# EAGLE schematic power_v1 (EAGLE 8.2.1)
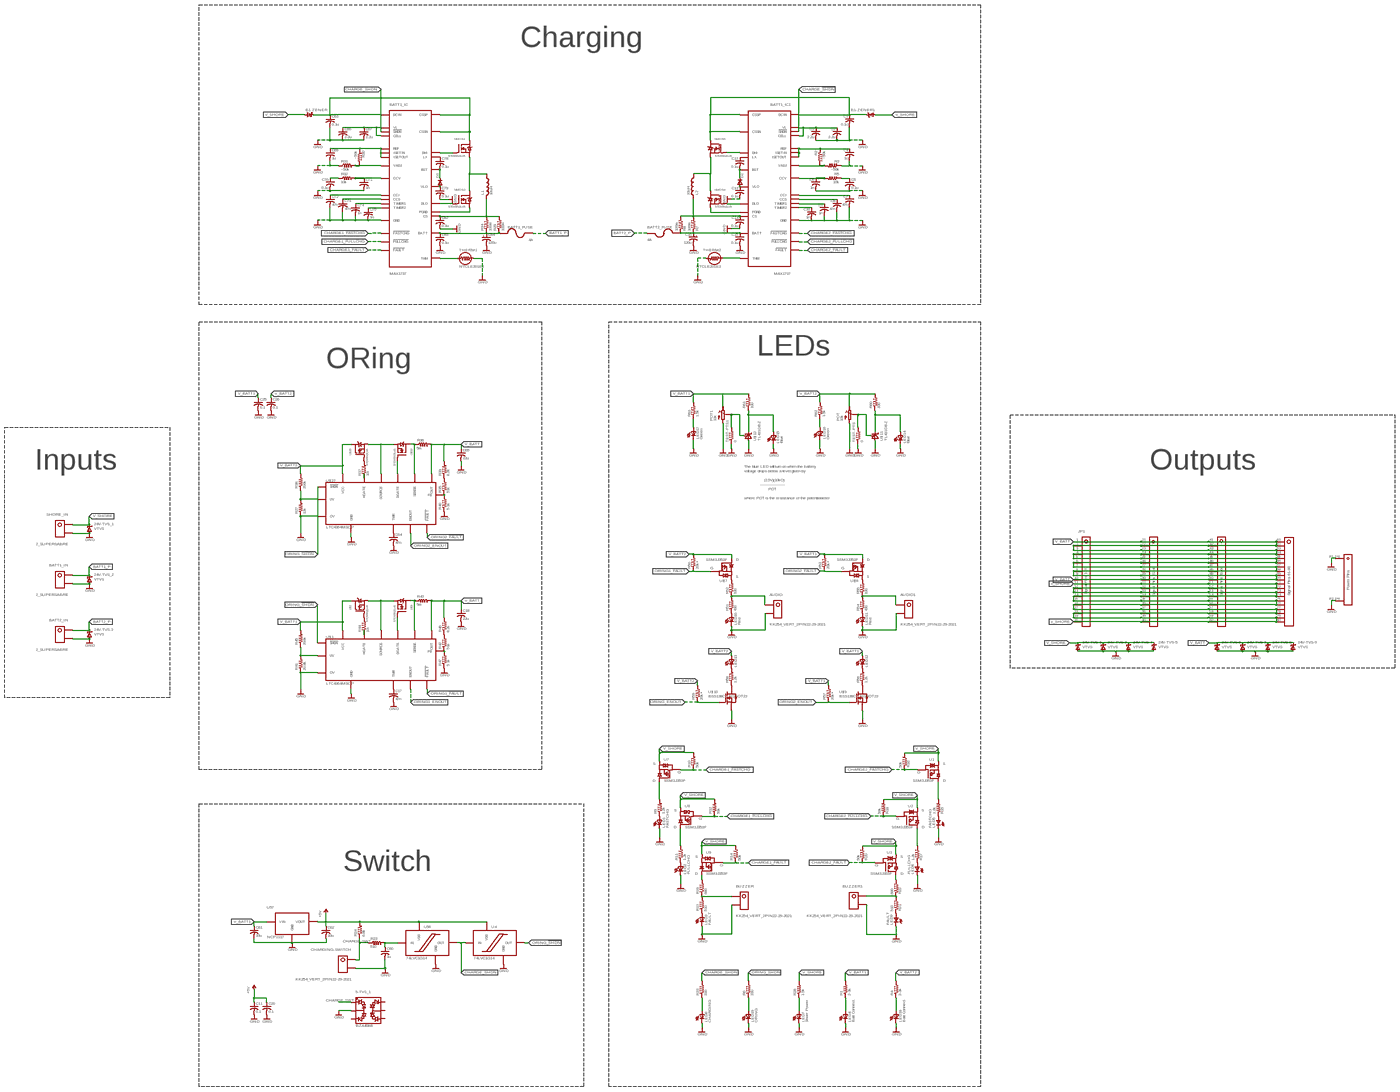
[diagram p0: schematic, sheet 1, overview]
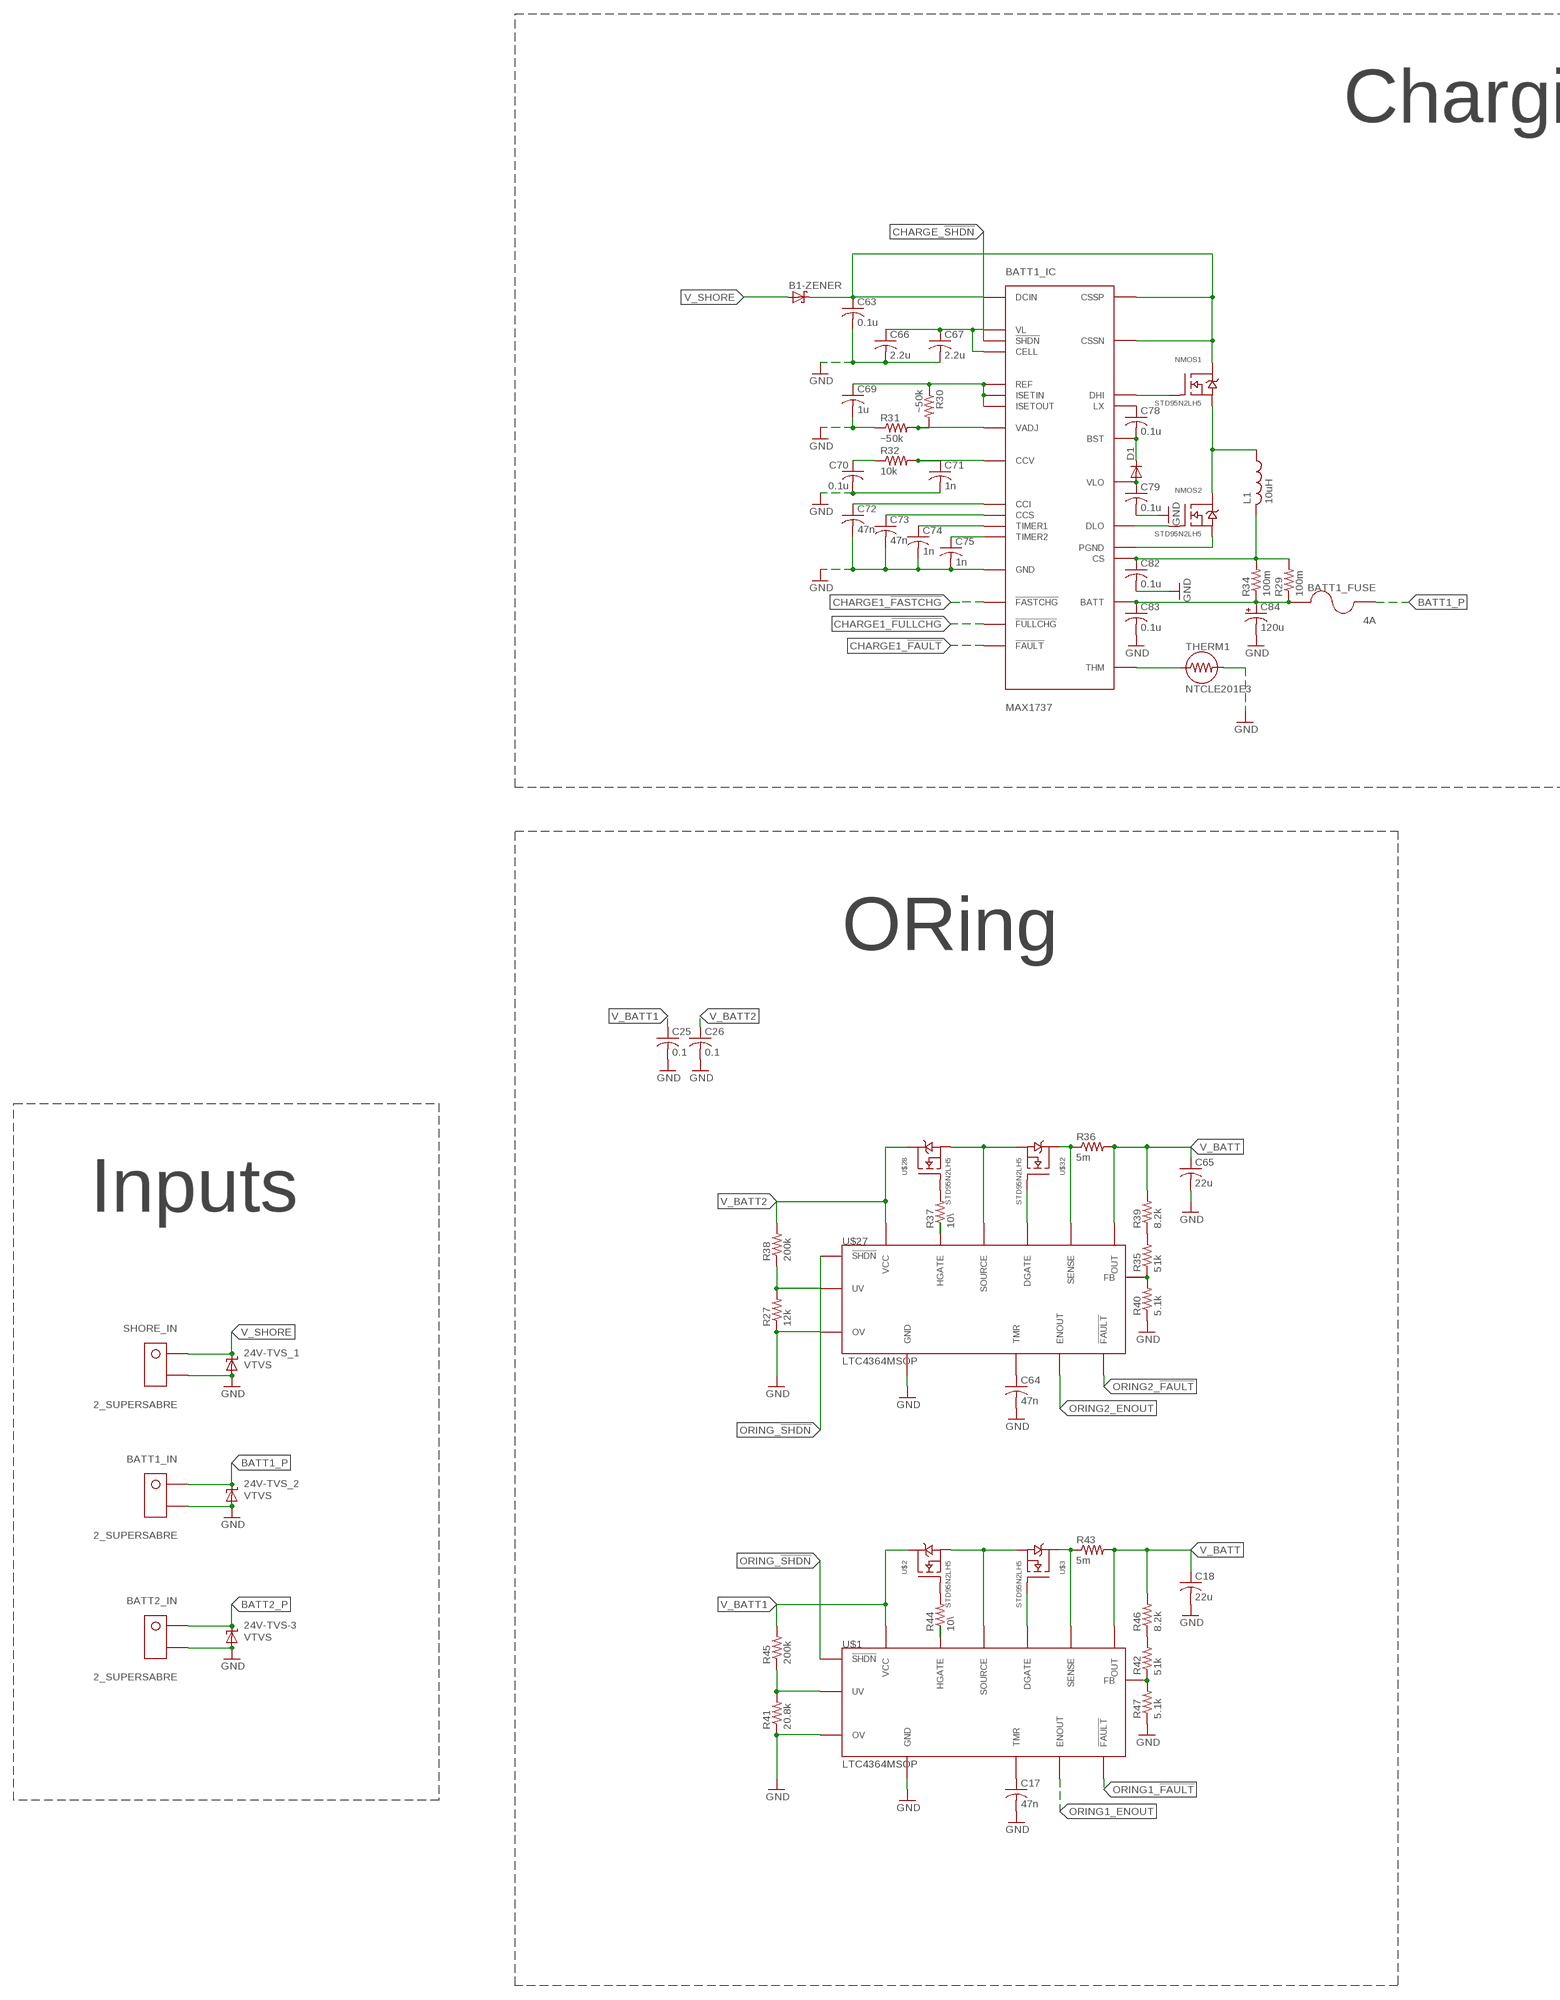
[diagram p1: schematic, sheet 1, part 1 of 4]
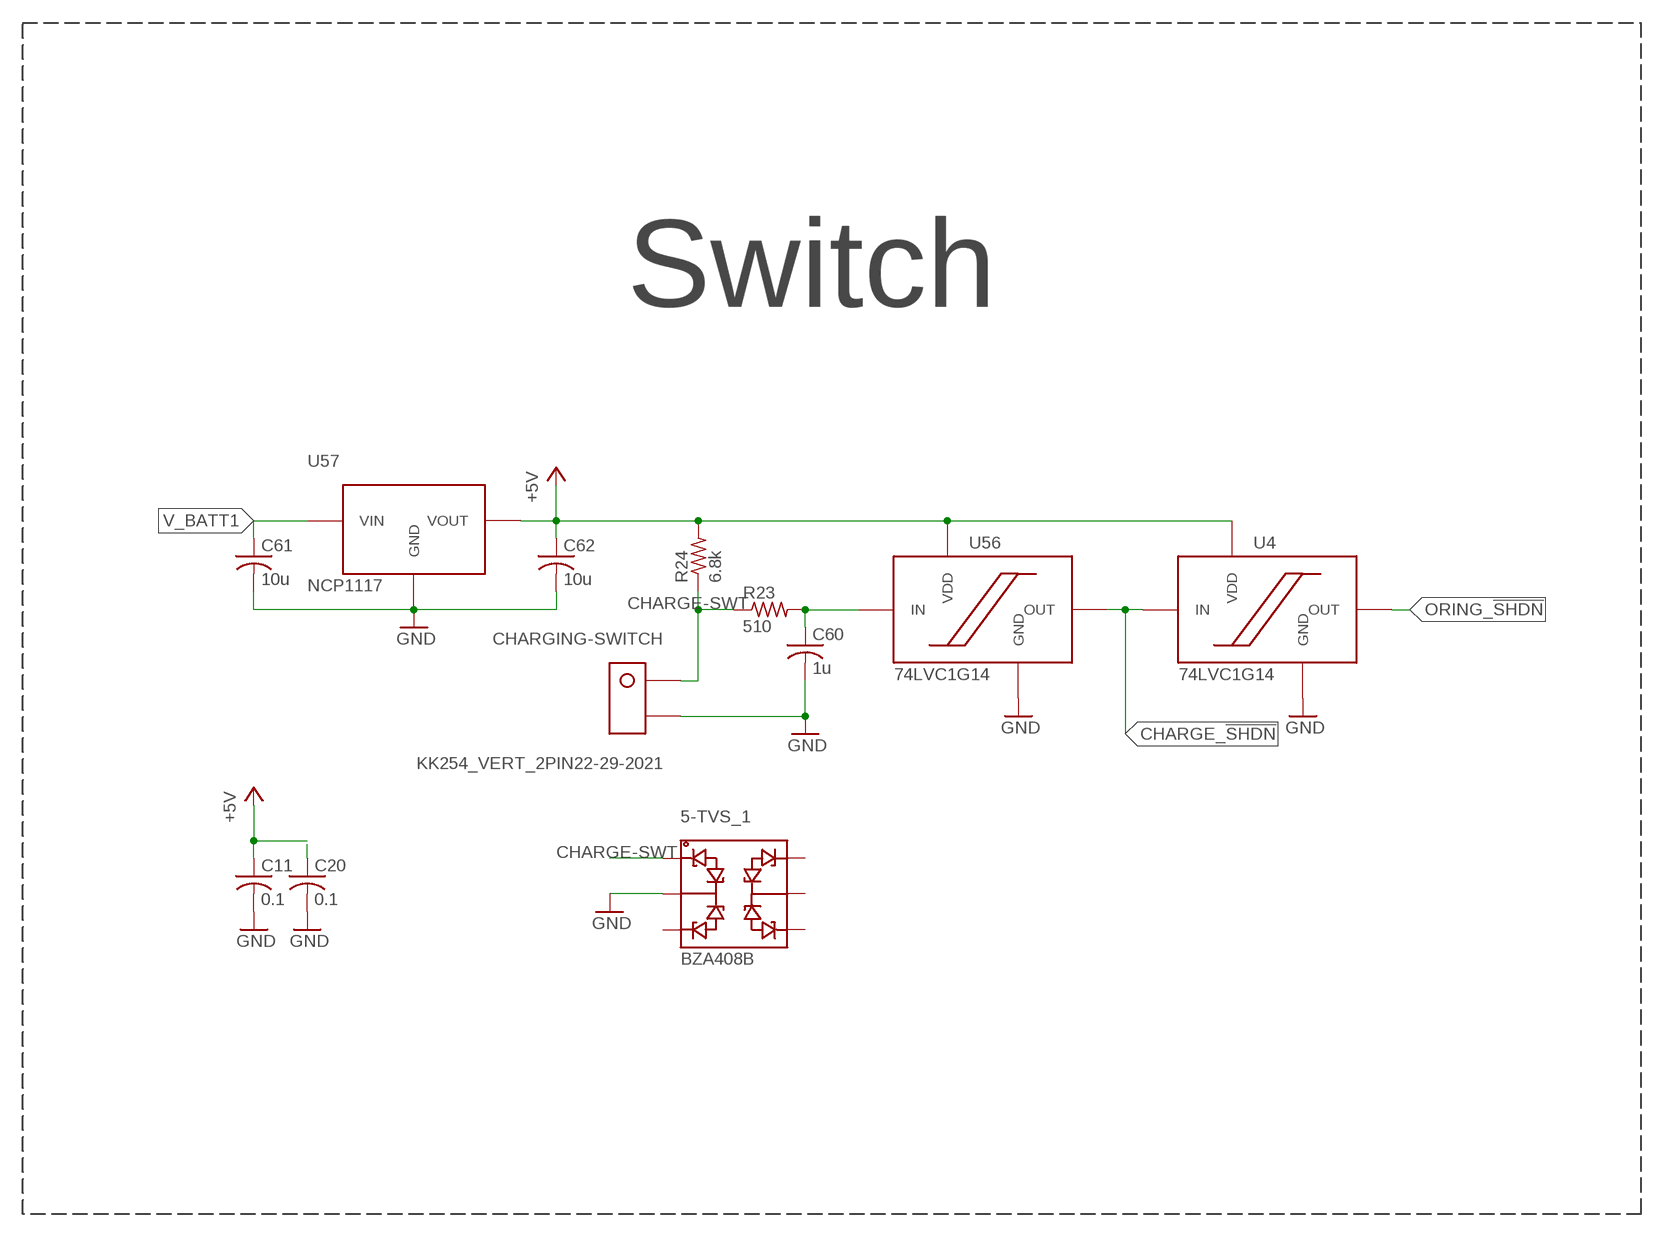
[diagram p2: schematic, sheet 1, part 2 of 4]
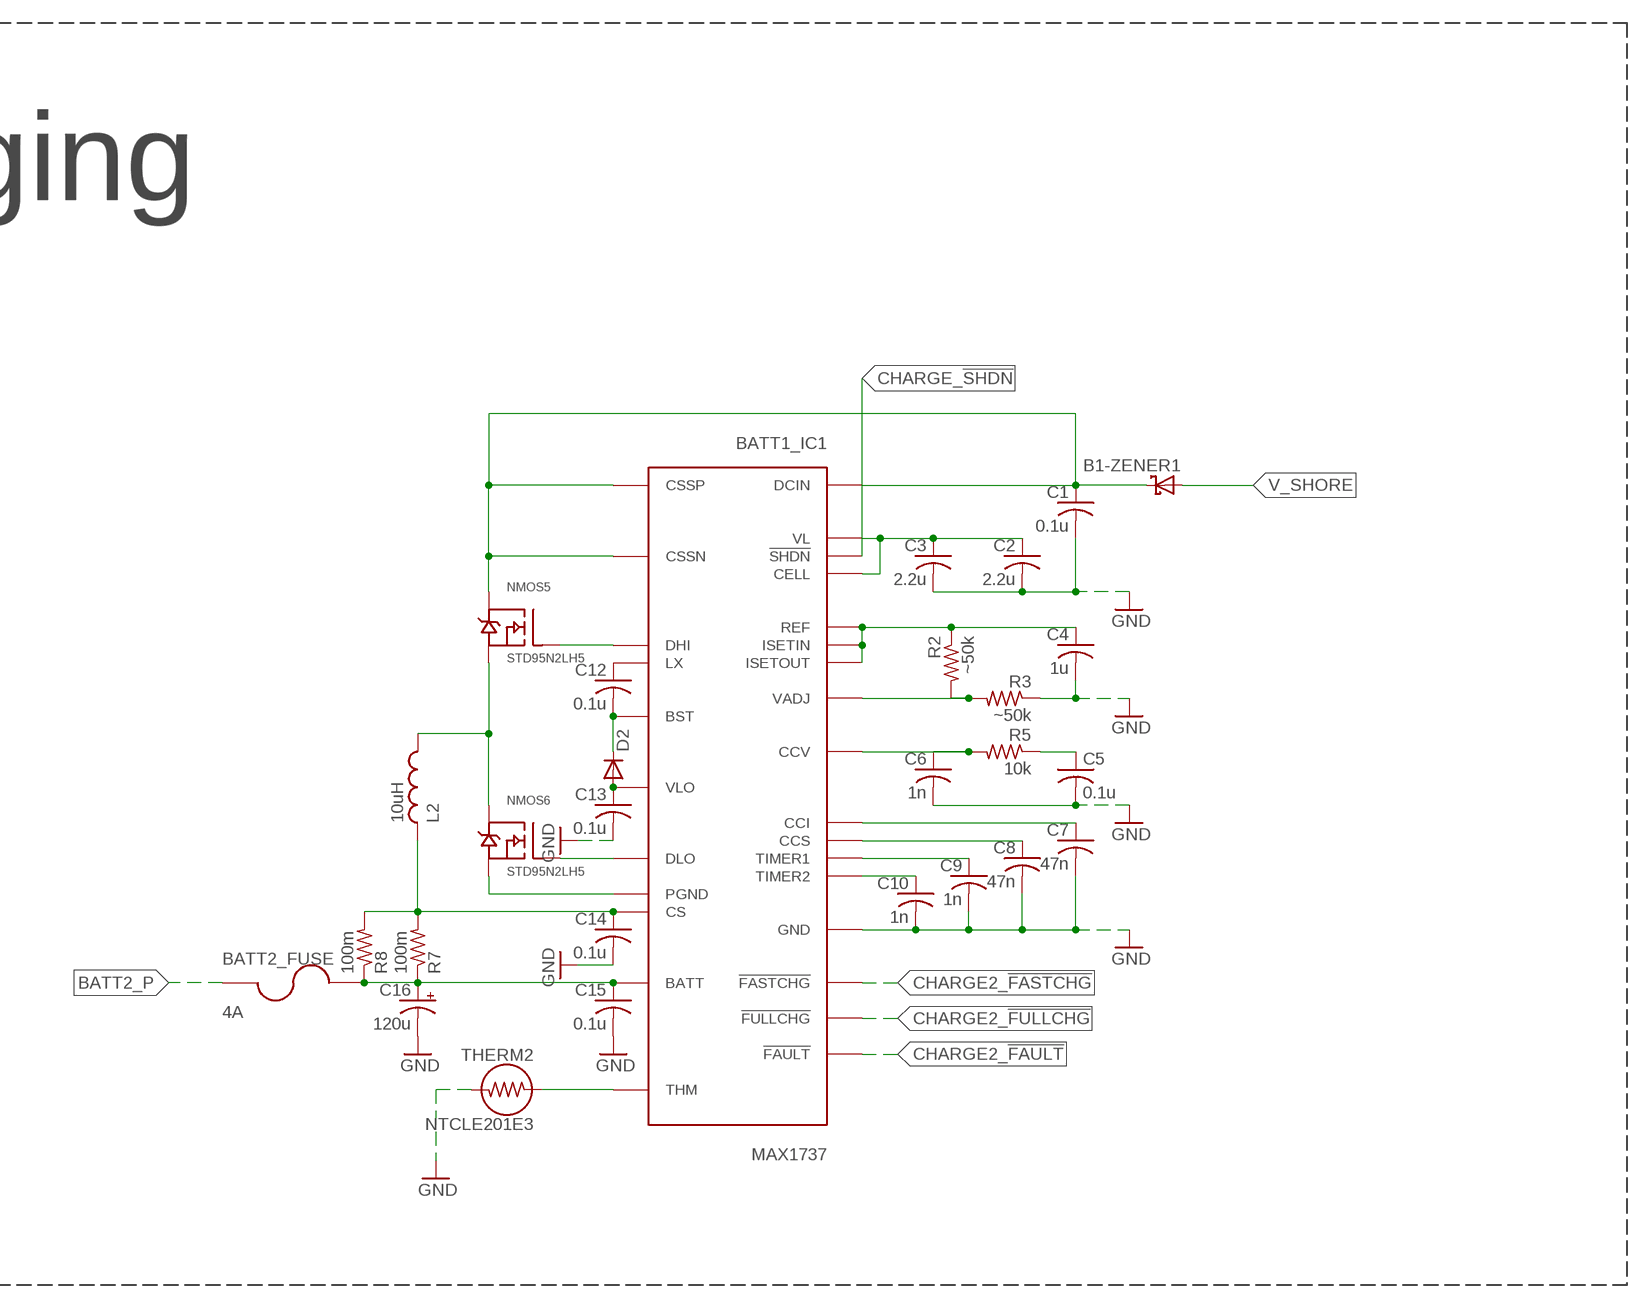
[diagram p3: schematic, sheet 1, part 3 of 4]
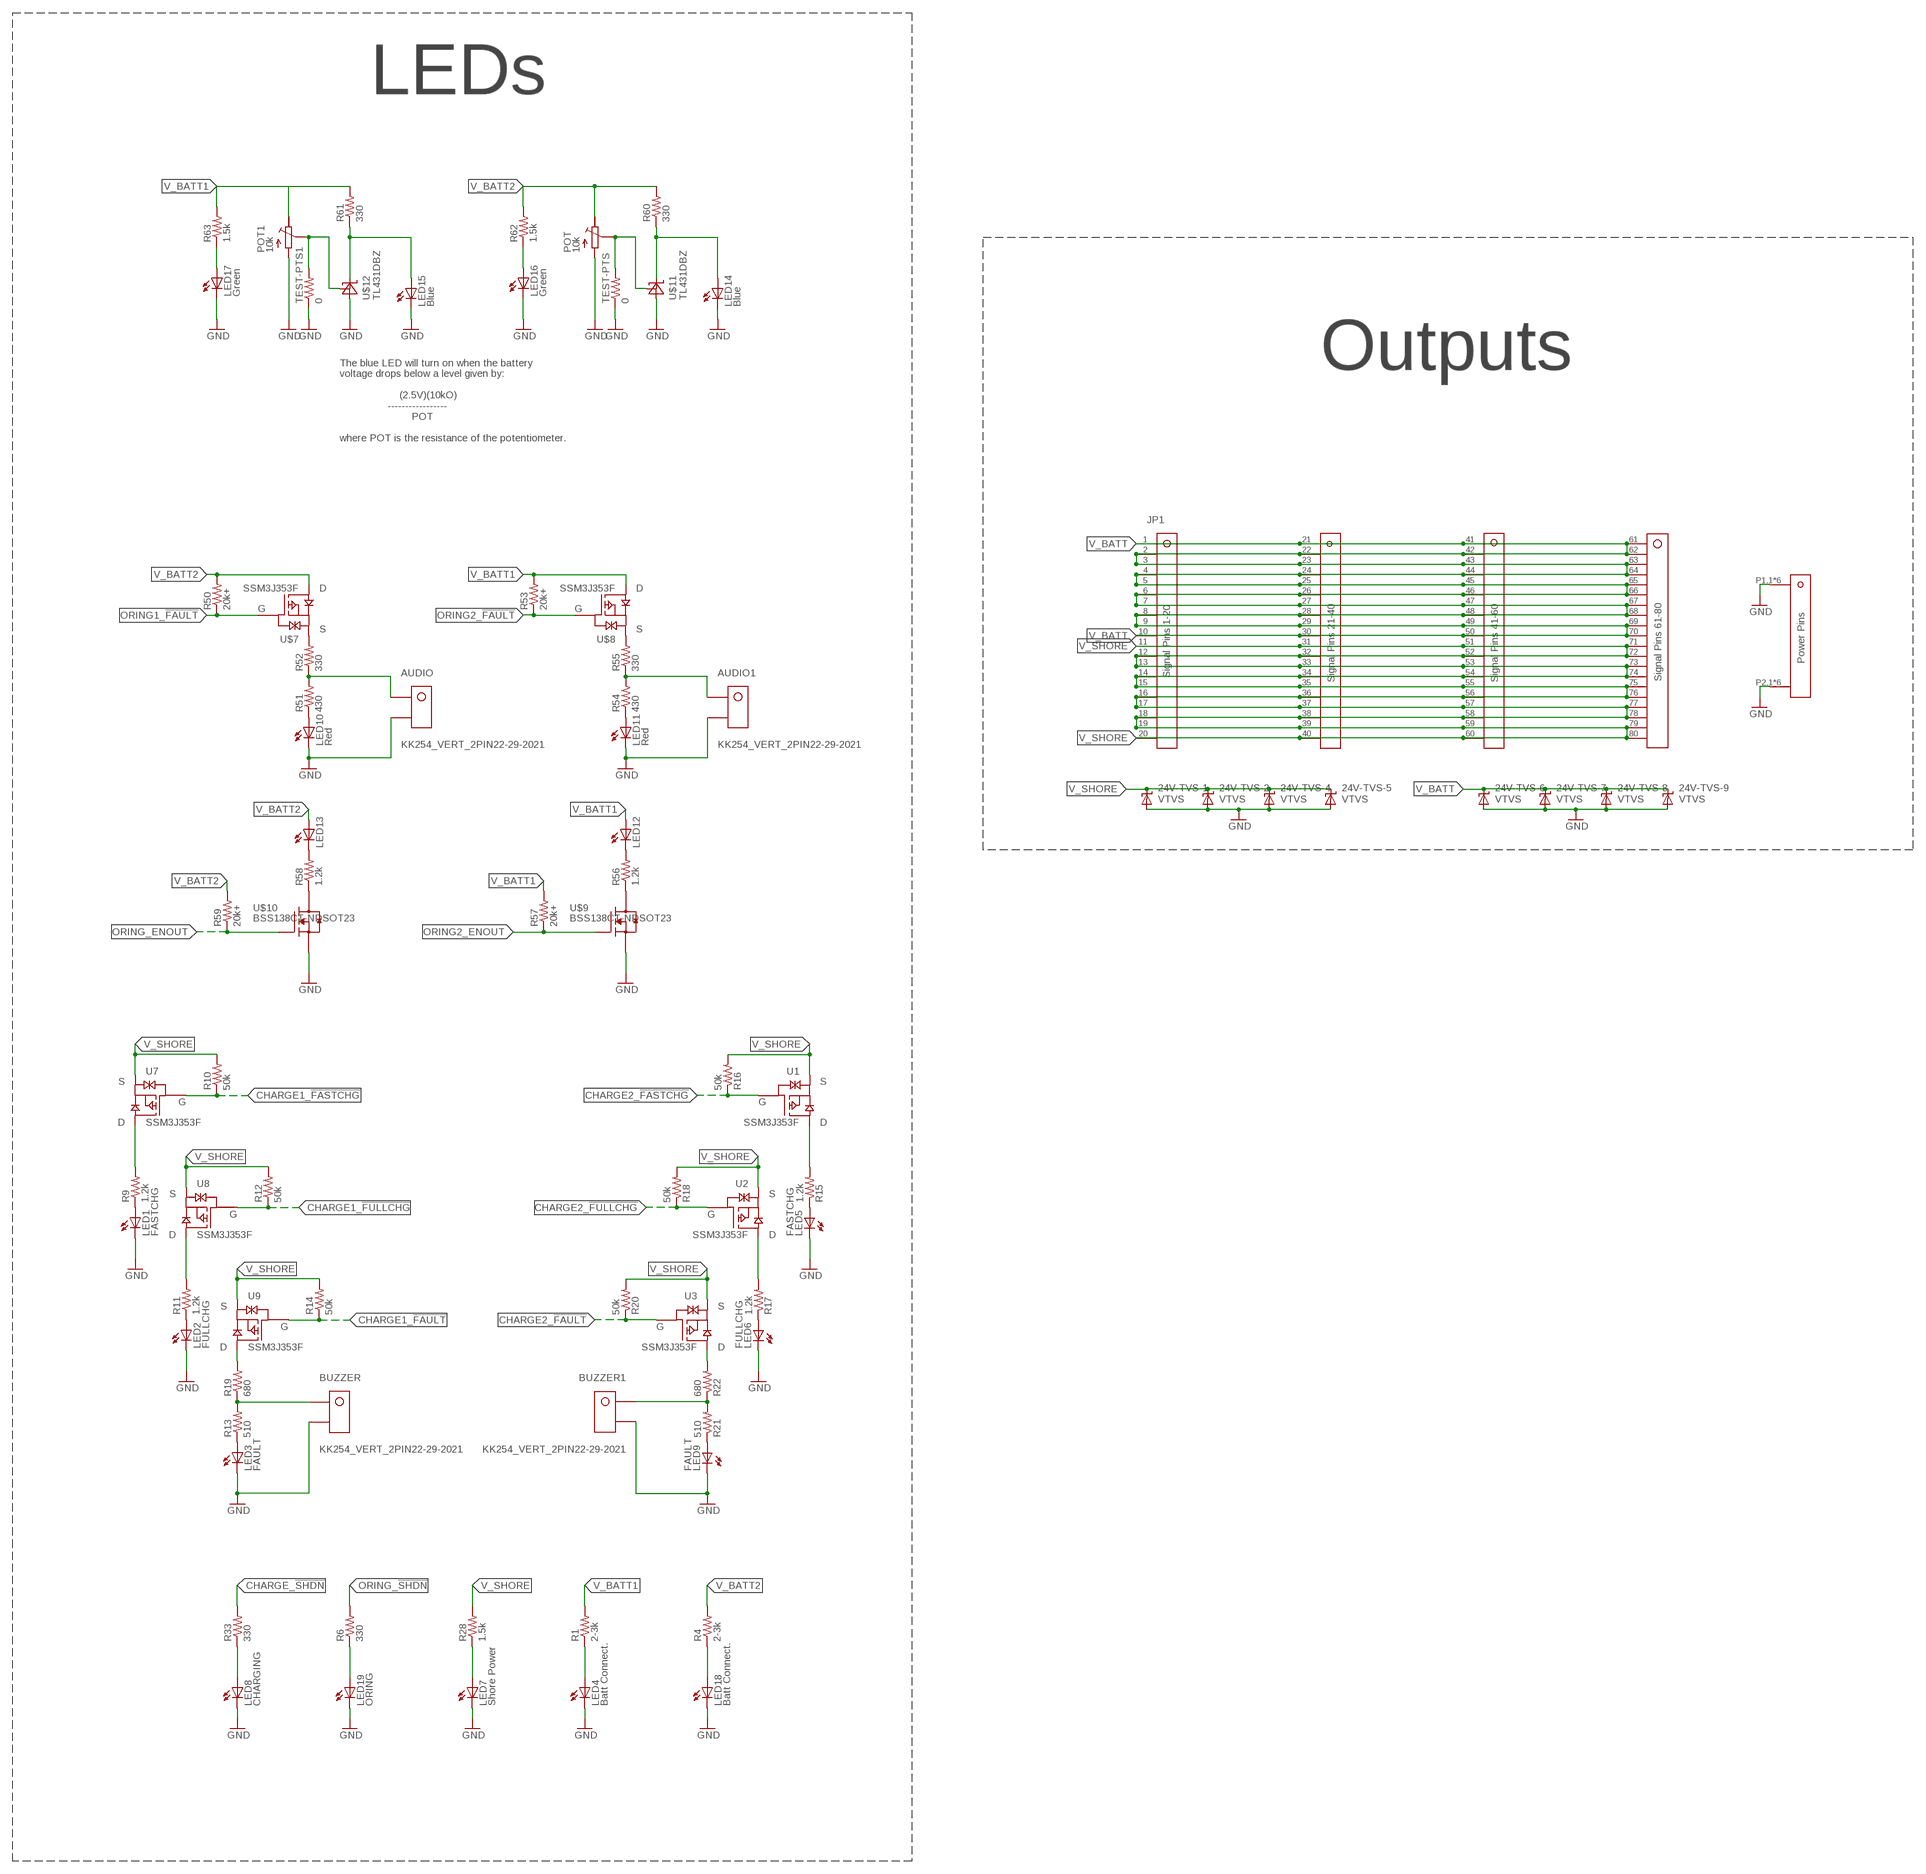
[diagram p4: schematic, sheet 1, part 4 of 4]

## Parts
5-TVS_1  BZA408B  [SOT457]
24V-TVS-1  VTVS  [DO-219AB]
24V-TVS-2  VTVS  [DO-219AB]
24V-TVS-3  VTVS  [DO-219AB]
24V-TVS-4  VTVS  [DO-219AB]
24V-TVS-5  VTVS  [DO-219AB]
24V-TVS-6  VTVS  [DO-219AB]
24V-TVS-7  VTVS  [DO-219AB]
24V-TVS-8  VTVS  [DO-219AB]
24V-TVS-9  VTVS  [DO-219AB]
24V-TVS_1  VTVS  [DO-219AB]
24V-TVS_2  VTVS  [DO-219AB]
AUDIO  KK254_VERT_2PIN22-29-2021  [KK254_VERT_2PIN]
AUDIO1  KK254_VERT_2PIN22-29-2021  [KK254_VERT_2PIN]
B1-ZENER  SCHOTTKY-DIODESOD-106  [SOD106-R]
B1-ZENER1  SCHOTTKY-DIODESOD-106  [SOD106-R]
BATT1_FUSE  4A  154-OMNI_BLOK  [154-OMNI-BLOK]
BATT1_IC  MAX1737  [QSOP28]
BATT1_IC1  MAX1737  [QSOP28]
BATT1_IN  2_SUPERSABRE  [SUPERSABRE_2CIRCUIT]
BATT2_FUSE  4A  154-OMNI_BLOK  [154-OMNI-BLOK]
BATT2_IN  2_SUPERSABRE  [SUPERSABRE_2CIRCUIT]
BUZZER  KK254_VERT_2PIN22-29-2021  [KK254_VERT_2PIN]
BUZZER1  KK254_VERT_2PIN22-29-2021  [KK254_VERT_2PIN]
C1  0.1u  C-USC0805  [C0805]
C2  2.2u  C-USC0805  [C0805]
C3  2.2u  C-USC0805  [C0805]
C4  1u  C-USC0805  [C0805]
C5  0.1u  C-USC0805  [C0805]
C6  1n  C-USC0805  [C0805]
C7  47n  C-USC0805  [C0805]
C8  47n  C-USC0805  [C0805]
C9  1n  C-USC0805  [C0805]
C10  1n  C-USC0805  [C0805]
C11  0.1  C-USC0805  [C0805]
C12  0.1u  C-USC0805  [C0805]
C13  0.1u  C-USC0805  [C0805]
C14  0.1u  C-USC0805  [C0805]
C15  0.1u  C-USC0805  [C0805]
C16  120u  CPOL-USE3.5-8  [E3,5-8]
C17  47n  C-USC0805  [C0805]
C18  22u  C-USC0805  [C0805]
C20  0.1  C-USC0805  [C0805]
C25  0.1  C-USC0805  [C0805]
C26  0.1  C-USC0805  [C0805]
C60  1u  C-USC0805  [C0805]
C61  10u  C-USC0805  [C0805]
C62  10u  C-USC0805  [C0805]
C63  0.1u  C-USC0805  [C0805]
C64  47n  C-USC0805  [C0805]
C65  22u  C-USC0805  [C0805]
C66  2.2u  C-USC0805  [C0805]
C67  2.2u  C-USC0805  [C0805]
C69  1u  C-USC0805  [C0805]
C70  0.1u  C-USC0805  [C0805]
C71  1n  C-USC0805  [C0805]
C72  47n  C-USC0805  [C0805]
C73  47n  C-USC0805  [C0805]
C74  1n  C-USC0805  [C0805]
C75  1n  C-USC0805  [C0805]
C78  0.1u  C-USC0805  [C0805]
C79  0.1u  C-USC0805  [C0805]
C82  0.1u  C-USC0805  [C0805]
C83  0.1u  C-USC0805  [C0805]
C84  120u  CPOL-USE3.5-8  [E3,5-8]
CHARGING-SWITCH  KK254_VERT_2PIN22-29-2021  [KK254_VERT_2PIN]
D1  DIODE-SOD123  [SOD123]
D2  DIODE-SOD123  [SOD123]
JP1  MPSC-01-80MPSC-RA-LC  [MPSC-01-80]
L1  10uH  L-USL6100  [L6100]
L2  10uH  L-USL6100  [L6100]
LED1  FASTCHG  LEDCHIP-LED0805  [CHIP-LED0805]
LED2  FULLCHG  LEDCHIP-LED0805  [CHIP-LED0805]
LED3  FAULT  LEDCHIP-LED0805  [CHIP-LED0805]
LED4  Batt Connect.  LEDCHIP-LED0805  [CHIP-LED0805]
LED5  FASTCHG  LEDCHIP-LED0805  [CHIP-LED0805]
LED6  FULLCHG  LEDCHIP-LED0805  [CHIP-LED0805]
LED7  Shore Power  LEDCHIP-LED0805  [CHIP-LED0805]
LED8  CHARGING  LEDCHIP-LED0805  [CHIP-LED0805]
LED9  FAULT  LEDCHIP-LED0805  [CHIP-LED0805]
LED10  Red  LEDCHIPLED_0805  [CHIPLED_0805]
LED11  Red  LEDCHIPLED_0805  [CHIPLED_0805]
LED12  LEDCHIPLED_0805  [CHIPLED_0805]
LED13  LEDCHIPLED_0805  [CHIPLED_0805]
LED14  Blue  0805_LED  [0805]
LED15  Blue  0805_LED  [0805]
LED16  Green  0805_LED  [0805]
LED17  Green  0805_LED  [0805]
LED18  Batt Connect.  LEDCHIP-LED0805  [CHIP-LED0805]
LED19  ORING  LEDCHIP-LED0805  [CHIP-LED0805]
NMOS1  STD95N2LH5  [DPAK]
NMOS2  STD95N2LH5  [DPAK]
NMOS5  STD95N2LH5  [DPAK]
NMOS6  STD95N2LH5  [DPAK]
POT  10k  R-TRIMM3314J  [RTRIM3314J]
POT1  10k  R-TRIMM3314J  [RTRIM3314J]
R1  2-3k  R-US_R0805  [R0805]
R2  ~50k  R-US_R0805  [R0805]
R3  ~50k  R-US_R0805  [R0805]
R4  2-3k  R-US_R0805  [R0805]
R5  10k  R-US_R0805  [R0805]
R6  330  R-US_R0805  [R0805]
R7  100m  R-US_R2512  [R2512]
R8  100m  R-US_R2512  [R2512]
R9  1.2k  R-US_R0805  [R0805]
R10  50k  R-US_R0805  [R0805]
R11  1.2k  R-US_R0805  [R0805]
R12  50k  R-US_R0805  [R0805]
R13  510  R-US_R0805  [R0805]
R14  50k  R-US_R0805  [R0805]
R15  1.2k  R-US_R0805  [R0805]
R16  50k  R-US_R0805  [R0805]
R17  1.2k  R-US_R0805  [R0805]
R18  50k  R-US_R0805  [R0805]
R19  680  R-US_R0805  [R0805]
R20  50k  R-US_R0805  [R0805]
R21  510  R-US_R0805  [R0805]
R22  680  R-US_R0805  [R0805]
R23  510  R-US_R0805  [R0805]
R24  6.8k  R-US_R0805  [R0805]
R27  12k  R-US_R0805  [R0805]
R28  1.5k  R-US_R0805  [R0805]
R29  100m  R-US_R2512  [R2512]
R30  ~50k  R-US_R0805  [R0805]
R31  ~50k  R-US_R0805  [R0805]
R32  10k  R-US_R0805  [R0805]
R33  330  R-US_R0805  [R0805]
R34  100m  R-US_R2512  [R2512]
R35  51k  R-US_R0805  [R0805]
R36  5m  R-US_R0805  [R0805]
R37  10\  R-US_R0805  [R0805]
R38  200k  R-US_R0805  [R0805]
R39  8.2k  R-US_R0805  [R0805]
R40  5.1k  R-US_R0805  [R0805]
R41  20.8k  R-US_R0805  [R0805]
R42  51k  R-US_R0805  [R0805]
R43  5m  R-US_R0805  [R0805]
R44  10\  R-US_R0805  [R0805]
R45  200k  R-US_R0805  [R0805]
R46  8.2k  R-US_R0805  [R0805]
R47  5.1k  R-US_R0805  [R0805]
R50  20k+  R-US_R0805  [R0805]
R51  430  R-US_R0805  [R0805]
R52  330  R-US_R0805  [R0805]
R53  20k+  R-US_R0805  [R0805]
R54  430  R-US_R0805  [R0805]
R55  330  R-US_R0805  [R0805]
R56  1.2k  R-US_R0805  [R0805]
R57  20k+  R-US_R0805  [R0805]
R58  1.2k  R-US_R0805  [R0805]
R59  20k+  R-US_R0805  [R0805]
R60  330  R-US_R0805  [R0805]
R61  330  R-US_R0805  [R0805]
R62  1.5k  R-US_R0805  [R0805]
R63  1.5k  R-US_R0805  [R0805]
SHORE_IN  2_SUPERSABRE  [SUPERSABRE_2CIRCUIT]
TEST-PTS  0  R-US_V526-0  [V526-0]
TEST-PTS1  0  R-US_V526-0  [V526-0]
THERM1  NTCLE201E3  [2-0.3MM-LEADS]
THERM2  NTCLE201E3  [2-0.3MM-LEADS]
U1  SSM3J353F  [SOT-346-3/S-MINI]
U2  SSM3J353F  [SOT-346-3/S-MINI]
U3  SSM3J353F  [SOT-346-3/S-MINI]
U4  74LVC1G14  [TSSOP5]
U7  SSM3J353F  [SOT-346-3/S-MINI]
U8  SSM3J353F  [SOT-346-3/S-MINI]
U9  SSM3J353F  [SOT-346-3/S-MINI]
U56  74LVC1G14  [TSSOP5]
U57  NCP1117  [SOT-223]
U$1  LTC4364MSOP  [MSOP16]
U$2  STD95N2LH5  [DPAK]
U$3  STD95N2LH5  [DPAK]
U$7  SSM3J353F  [SOT-346-3/S-MINI]
U$8  SSM3J353F  [SOT-346-3/S-MINI]
U$9  BSS138CT-NDSOT23  [SOT23]
U$10  BSS138CT-NDSOT23  [SOT23]
U$11  TL431DBZ  [SOT-23-3]
U$12  TL431DBZ  [SOT-23-3]
U$27  LTC4364MSOP  [MSOP16]
U$28  STD95N2LH5  [DPAK]
U$32  STD95N2LH5  [DPAK]

## Nets
+5V: C11.1 C20.1 C62.1 R24.2 U4.P$5(VDD) U56.P$5(VDD) U57.P$2(VOUT) U57.P$4(VOUT)
BATT1_P: 24V-TVS_2.P$2(C) BATT1_FUSE.P$1 BATT1_IN.P$1
BATT2_P: 24V-TVS-3.P$2(C) BATT2_FUSE.P$1 BATT2_IN.P$1
BATT_1: BATT1_FUSE.P$2 BATT1_IC.7(BATT) C83.1 C84.+ R29.1 R34.1
BATT_2: BATT1_IC1.7(BATT) BATT2_FUSE.P$2 C15.1 C16.+ R7.1 R8.1
CCI_1: BATT1_IC.11(CCI) C72.1
CCI_2: BATT1_IC1.11(CCI) C7.1
CCS_1: BATT1_IC.10(CCS) C73.1
CCS_2: BATT1_IC1.10(CCS) C8.1
CCV_1: BATT1_IC.9(CCV) C71.1 R32.2
CCV_2: BATT1_IC1.9(CCV) C6.1 R5.2
CHARGE1_!FASTCHG!: BATT1_IC.16(!FASTCHG!) R10.1 U7.P$1(G)
CHARGE1_!FAULT!: BATT1_IC.15(!FAULT!) R14.1 U9.P$1(G)
CHARGE1_!FULLCHG!: BATT1_IC.17(!FULLCHG!) R12.1 U8.P$1(G)
CHARGE2_!FASTCHG!: BATT1_IC1.16(!FASTCHG!) R16.1 U1.P$1(G)
CHARGE2_!FAULT!: BATT1_IC1.15(!FAULT!) R20.1 U3.P$1(G)
CHARGE2_!FULLCHG!: BATT1_IC1.17(!FULLCHG!) R18.1 U2.P$1(G)
CHARGE-SWT: 5-TVS_1.P$1 CHARGING-SWITCH.P$1 R23.1 R24.1
CHARGE_!SHDN!: BATT1_IC1.18(!SHDN!) BATT1_IC.18(!SHDN!) R33.2 U4.P$2(IN) U56.P$4(OUT)
DCIN_1: B1-ZENER.C BATT1_IC.26(CSSN) BATT1_IC.27(CSSP) BATT1_IC.28(DCIN) C63.1 NMOS1.TAB(D)
DCIN_2: B1-ZENER1.C BATT1_IC1.26(CSSN) BATT1_IC1.27(CSSP) BATT1_IC1.28(DCIN) C1.1 NMOS5.TAB(D)
DHI1: BATT1_IC.25(DHI) NMOS1.1(G)
DHI2: BATT1_IC1.25(DHI) NMOS5.1(G)
DLO1: BATT1_IC.21(DLO) NMOS2.1(G)
DLO2: BATT1_IC1.21(DLO) NMOS6.1(G)
GND: 5-TVS_1.P$2 24V-TVS-1.P$1(A) 24V-TVS-2.P$1(A) 24V-TVS-3.P$1(A) 24V-TVS-4.P$1(A) 24V-TVS-5.P$1(A) 24V-TVS-6.P$1(A) 24V-TVS-7.P$1(A) 24V-TVS-8.P$1(A) 24V-TVS-9.P$1(A) 24V-TVS_1.P$1(A) 24V-TVS_2.P$1(A) AUDIO1.P$2 AUDIO.P$2 BATT1_IC1.6(GND) BATT1_IC.6(GND) BATT1_IN.P$2 BATT2_IN.P$2 BUZZER1.P$2 BUZZER.P$2 C1.2 C2.2 C3.2 C4.2 C5.2 C6.2 C7.2 C8.2 C9.2 C10.2 C11.2 C13.2 C14.2 C15.2 C16.- C17.2 C18.2 C20.2 C25.2 C26.2 C60.2 C61.2 C62.2 C63.2 C64.2 C65.2 C66.2 C67.2 C69.2 C70.2 C71.2 C72.2 C73.2 C74.2 C75.2 C79.2 C82.2 C83.2 C84.- CHARGING-SWITCH.P$2 JP1.P1,1(POWER1) JP1.P1,2(POWER1) JP1.P1,3(POWER1) JP1.P1,4(POWER1) JP1.P1,5(POWER1) JP1.P1,6(POWER1) JP1.P2,1(POWER2) JP1.P2,2(POWER2) JP1.P2,3(POWER2) JP1.P2,4(POWER2) JP1.P2,5(POWER2) JP1.P2,6(POWER2) LED1.C LED2.C LED3.C LED4.C LED5.C LED6.C LED7.C LED8.C LED9.C LED10.C LED11.C LED14.P$2(C) LED15.P$2(C) LED16.P$2(C) LED17.P$2(C) LED18.C LED19.C POT1.1(E) POT.1(E) R3.1 R27.1 R31.1 R40.1 R41.1 R47.1 SHORE_IN.P$2 TEST-PTS1.1 TEST-PTS.1 THERM1.P$2 THERM2.P$2 U4.P$3(GND) U56.P$3(GND) U57.P$1(GND) U$1.GND U$1.OV U$9.2(S) U$10.2(S) U$11.P$3(A) U$12.P$3(A) U$27.GND U$27.OV
LIN_1: L1.P$1 NMOS1.3(S) NMOS2.TAB(D)
LIN_2: L2.P$1 NMOS5.3(S) NMOS6.TAB(D)
LOUT_1: BATT1_IC.19(CS) C82.1 L1.P$2 R29.2 R34.2
LOUT_2: BATT1_IC1.19(CS) C14.1 L2.P$2 R7.2 R8.2
N$1: LED4.A R1.1
N$2: LED1.A R9.1
N$3: BATT1_IC.20(PGND) NMOS2.3(S)
N$4: C5.1 R5.1
N$5: BATT1_IC1.24(LX) C12.1
N$6: BATT1_IC1.23(BST) C12.2 D2.C
N$7: BATT1_IC1.22(VLO) C13.1 D2.A
N$8: LED5.A R15.1
N$9: R15.2 U1.P$2(D)
N$10: LED6.A R17.1
N$11: R17.2 U2.P$2(D)
N$12: LED3.A R13.1
N$13: LED9.A R21.1
N$14: BUZZER1.P$1 R21.2 R22.1
N$15: R22.2 U3.P$2(D)
N$16: BATT1_IC1.20(PGND) NMOS6.3(S)
N$17: R35.2 R39.1
N$18: U$27.SOURCE U$28.3(S) U$32.3(S)
N$19: R41.2 R45.1 U$1.UV
N$20: R42.1 R47.2 U$1.FB
N$21: R44.1 U$1.HGATE
N$22: LED2.A R11.1
N$23: R9.2 U7.P$2(D)
N$24: C17.1 U$1.TMR
N$25: R42.2 R46.1
N$26: R11.2 U8.P$2(D)
N$27: R44.2 U$2.1(G)
N$28: U$1.SOURCE U$2.3(S) U$3.3(S)
N$29: BUZZER.P$1 R13.2 R19.1
N$30: R19.2 U9.P$2(D)
N$31: R43.1 U$1.SENSE U$3.TAB(D)
N$32: U$1.DGATE U$3.1(G)
N$35: LED7.A R28.1
N$37: R37.1 U$27.HGATE
N$38: LED18.A R4.1
N$39: R27.2 R38.1 U$27.UV
N$40: LED10.A R51.1
N$41: LED19.A R6.1
N$42: R52.2 U$7.P$3(S)
N$43: AUDIO.P$1 R51.2 R52.1
N$44: LED11.A R54.1
N$46: R55.2 U$8.P$3(S)
N$49: C60.1 R23.2 U56.P$2(IN)
N$50: R35.1 R40.2 U$27.FB
N$53: C64.1 U$27.TMR
N$55: AUDIO1.P$1 R54.2 R55.1
N$56: R56.1 U$9.3(D)
N$57: LED8.A R33.1
N$58: LED12.C R56.2
N$59: R37.2 U$28.1(G)
N$60: R36.1 U$27.SENSE U$32.TAB(D)
N$61: U$27.DGATE U$32.1(G)
N$62: R58.1 U$10.3(D)
N$63: LED13.C R58.2
N$64: C70.1 R32.1
N$65: POT.2(S) TEST-PTS.2 U$11.P$2(REF)
N$66: LED14.P$1(A) R60.1 U$11.P$1(C)
N$67: POT1.2(S) TEST-PTS1.2 U$12.P$2(REF)
N$68: LED15.P$1(A) R61.1 U$12.P$1(C)
N$71: LED16.P$1(A) R62.1
N$72: LED17.P$1(A) R63.1
N$75: BATT1_IC.24(LX) C78.1
N$76: BATT1_IC.23(BST) C78.2 D1.C
N$83: BATT1_IC.22(VLO) C79.1 D1.A
ORING1_!FAULT!: R50.1 U$1.FLT(!FAULT!) U$7.P$1(G)
ORING1_ENOUT: U$1.ENOUT
ORING2_!FAULT!: R53.1 U$8.P$1(G) U$27.FLT(!FAULT!)
ORING2_ENOUT: R57.1 U$9.1(G) U$27.ENOUT
ORING_!SHDN!: R6.2 U4.P$4(OUT) U$1.SHDN(!SHDN!) U$27.SHDN(!SHDN!)
ORING_ENOUT: R59.1 U$10.1(G)
REF_1: BATT1_IC.2(ISETIN) BATT1_IC.3(ISETOUT) BATT1_IC.5(REF) C69.1 R30.1
REF_2: BATT1_IC1.2(ISETIN) BATT1_IC1.3(ISETOUT) BATT1_IC1.5(REF) C4.1 R2.1
THM1: BATT1_IC.4(THM) THERM1.P$1
THM2: BATT1_IC1.4(THM) THERM2.P$1
TIMER1_1: BATT1_IC.13(TIMER1) C74.1
TIMER1_2: BATT1_IC1.13(TIMER1) C9.1
TIMER2_1: BATT1_IC.14(TIMER2) C75.1
TIMER2_2: BATT1_IC1.14(TIMER2) C10.1
V_BATT: 24V-TVS-6.P$2(C) 24V-TVS-7.P$2(C) 24V-TVS-8.P$2(C) 24V-TVS-9.P$2(C) C18.1 C65.1 JP1.1 JP1.2 JP1.3 JP1.4 JP1.5 JP1.6 JP1.7 JP1.8 JP1.9 JP1.10 JP1.21 JP1.22 JP1.23 JP1.24 JP1.25 JP1.26 JP1.27 JP1.28 JP1.29 JP1.30 JP1.41 JP1.42 JP1.43 JP1.44 JP1.45 JP1.46 JP1.47 JP1.48 JP1.49 JP1.50 JP1.61 JP1.62 JP1.63 JP1.64 JP1.65 JP1.66 JP1.67 JP1.68 JP1.69 JP1.70 R36.2 R39.2 R43.2 R46.2 U$1.OUT U$27.OUT
V_BATT1: C25.1 C61.1 LED12.A POT1.3(A) R1.2 R45.2 R53.2 R57.2 R61.2 R63.2 U57.P$3(VIN) U$1.VCC U$2.TAB(D) U$8.P$2(D)
V_BATT2: C26.1 LED13.A POT.3(A) R4.2 R38.2 R50.2 R59.2 R60.2 R62.2 U$7.P$2(D) U$27.VCC U$28.TAB(D)
V_SHORE: 24V-TVS-1.P$2(C) 24V-TVS-2.P$2(C) 24V-TVS-4.P$2(C) 24V-TVS-5.P$2(C) 24V-TVS_1.P$2(C) B1-ZENER1.A B1-ZENER.A JP1.11 JP1.12 JP1.13 JP1.14 JP1.15 JP1.16 JP1.17 JP1.18 JP1.19 JP1.20 JP1.31 JP1.32 JP1.33 JP1.34 JP1.35 JP1.36 JP1.37 JP1.38 JP1.39 JP1.40 JP1.51 JP1.52 JP1.53 JP1.54 JP1.55 JP1.56 JP1.57 JP1.58 JP1.59 JP1.60 JP1.71 JP1.72 JP1.73 JP1.74 JP1.75 JP1.76 JP1.77 JP1.78 JP1.79 JP1.80 R10.2 R12.2 R14.2 R16.2 R18.2 R20.2 R28.2 SHORE_IN.P$1 U1.P$3(S) U2.P$3(S) U3.P$3(S) U7.P$3(S) U8.P$3(S) U9.P$3(S)
VADJ_1: BATT1_IC.8(VADJ) R30.2 R31.2
VADJ_2: BATT1_IC1.8(VADJ) R2.2 R3.2
VL_1: BATT1_IC.1(VL) BATT1_IC.12(CELL) C66.1 C67.1
VL_2: BATT1_IC1.1(VL) BATT1_IC1.12(CELL) C2.1 C3.1
Unconnected: 5-TVS_1.P$3 5-TVS_1.P$4 5-TVS_1.P$5 5-TVS_1.P$6

## Notes on the sheet
- Charging
- LEDs
- ORing
- Inputs | Outputs
- The blue LED will turn on when the battery
  voltage drops below a level given by:
  
                      (2.5V)(10kO)
                  -----------------
                          POT
  
  where POT is the resistance of the potentiometer.
- Switch

## Library data of the parts
5-TVS_1 = diodes:BZA408B: Nexperia BZA408B 5V TVS diode Datasheet <http://www.mouser.com/ds/2/302/BZA408B-841090.pdf>
24V-TVS-1-24V-TVS-9 24V-TVS_1 24V-TVS_2 = diode:VTVS: Vishay VTVS5V0ASMF to VTVS63GSMF 400W TVS diodes Datasheet <http://www.mouser.com/ds/2/427/vtvs5v0asmf-1078013.pdf>
AUDIO AUDIO1 BUZZER BUZZER1 CHARGING-SWITCH = molex:KK254_VERT_2PIN: KK® 254 Wire-to-Board Header, Vertical, with Friction Lock, 2 Circuits, Gold (Au) Plating Part Number: 22-29-2021 http://www.molex.com/molex/products/datasheet.jsp?part=active/0022292021_PCB_HEADERS.xml
B1-ZENER B1-ZENER1 = diode:SCHOTTKY-DIODE: Schottky Diode
BATT1_FUSE BATT2_FUSE = littelfuse:154-OMNI_BLOK: Littelfuse NANO2 Series 154 Omni-Blok fuseholder Datasheet <http://www.mouser.com/ds/2/240/Littelfuse_Fuse_154_154T_154L_154TL_Datasheet.pdf-309941.pdf>
BATT1_IC BATT1_IC1 = maxim:MAX1737: Maxim MAX1737 Stand-Alone Switch-Mode Lithium-Ion Battery-Charger Controller 1-4 cell LiPo charge controller IC Datasheet <https://datasheets.maximintegrated.com/en/ds/MAX1737.pdf>
BATT1_IN BATT2_IN SHORE_IN = molex:2_SUPERSABRE: Molex SuperSabre 2-pin vertical header
C1-C15 C17 C18 C20 C25 C26 C60-C67 C69-C75 C78 C79 C82 C83 = resistor:C-US: CAPACITOR, American symbol
C16 C84 = resistor:CPOL-US: POLARIZED CAPACITOR, American symbol
D1 D2 = diode:DIODE-: DIODE
JP1 = samtec:MPSC-01-80
L1 L2 = resistor:L-US: INDUCTOR, American symbol
LED1-LED13 LED18 LED19 = led:LED: LED OSRAM: - CHIPLED LG R971, LG N971, LY N971, LG Q971, LY Q971, LO R971, LY R971 LH N974, LH R974 LS Q976, LO Q976, LY Q976 LO Q996 - Hyper CHIPLED LW Q18S LB Q993, LB Q99A, LB R99A - SideLED LS A670, LO A670, LY A670, LG A670, LP A670 LB A673, LV A673, LT A673, LW A673 LH A674 LY A675 LS A676, LA A676, LO A676, LY A676, LW A676 LS A679, LY A679, LG A679 - Hyper Micro SIDELED® LS Y876, LA Y876, LO Y876, LY Y876 LT Y87S - SmartLED LW L88C, LW L88S LB L89C, LB L89S, LG L890 LS L89K, LO L89K, LY L89K LS L896, LA L896, LO L896, LY L896 - TOPLED LS T670, LO T670, LY T670, LG T670, LP T670 LSG T670, LSP T670, LSY T670, LOP T670, LYG T670 LG T671, LOG T671, LSG T671 LB T673, LV T673, LT T673, LW T673 LH T674 LS T676, LA T676, LO T676, LY T676, LB T676, LH T676, LSB T676, LW T676 LB T67C, LV T67C, LT T67C, LS T67K, LO T67K, LY T67K, LW E67C LS E67B, LA E67B, LO E67B, LY E67B, LB E67C, LV E67C, LT E67C LW T67C LS T679, LY T679, LG T679 LS T770, LO T770, LY T770, LG T770, LP T770 LB T773, LV T773, LT T773, LW T773 LH T774 LS E675, LA E675, LY E675, LS T675 LS T776, LA T776, LO T776, LY T776, LB T776 LHGB T686 LT T68C, LB T68C - Hyper Mini TOPLED® LB M676 - Mini TOPLED Santana® LG M470 LS M47K, LO M47K, LY M47K Source: http://www.osram.convergy.de LUXEON: - LUMILED® LXK2-PW12-R00, LXK2-PW12-S00, LXK2-PW14-U00, LXK2-PW14-V00 LXK2-PM12-R00, LXK2-PM12-S00, LXK2-PM14-U00 LXK2-PE12-Q00, LXK2-PE12-R00, LXK2-PE12-S00, LXK2-PE14-T00, LXK2-PE14-U00 LXK2-PB12-K00, LXK2-PB12-L00, LXK2-PB12-M00, LXK2-PB14-N00, LXK2-PB14-P00, LXK2-PB14-Q00 LXK2-PR12-L00, LXK2-PR12-M00, LXK2-PR14-Q00, LXK2-PR14-R00 LXK2-PD12-Q00, LXK2-PD12-R00, LXK2-PD12-S00 LXK2-PH12-R00, LXK2-PH12-S00 LXK2-PL12-P00, LXK2-PL12-Q00, LXK2-PL12-R00 Source: www.luxeon.com KINGBRIGHT: KA-3528ASYC Source: www.kingbright.com
LED14-LED17 = led:0805_LED: LED, 0805 package. Any variety.
NMOS1 NMOS2 NMOS5 NMOS6 U$2 U$3 U$28 U$32 = transistors:STD95N2LH5: ST STD95N2LH5 NMOS Power FET Datasheet <http://www.mouser.com/ds/2/389/std95n2lh5-955773.pdf>
POT POT1 = resistor:R-TRIMM: Trimm resistor
R1-R24 R27-R47 R50-R63 TEST-PTS TEST-PTS1 = resistor:R-US_: RESISTOR, American symbol
THERM1 THERM2 = vishay:NTCLE201E3: Vishay NTC Thermistor Part No. NTCLE201E3 Datasheet <http://www.mouser.com/ds/2/427/ntclesb-278158.pdf>
U1-U3 U7-U9 U$7 U$8 = transistors:SSM3J353F: Toshiba SSM3J353F Small signal PMOS Datasheet <http://www.mouser.com/ds/2/408/SSM3J353F_datasheet_en_20161219-981025.pdf>
U4 U56 = NXP:74LVC1G14: Nexperia 74LVC1G14 Single Schmitt trigger inverter Datasheet <http://www.mouser.com/ds/2/302/74LVC1G14_Q100-839654.pdf>
U57 = ONSemi:NCP1117: ON Semiconductor NCP1117 5V 1A Fixed LDO Datasheet <http://www.mouser.com/ds/2/308/NCP1117-D-81326.pdf>
U$1 U$27 = linear:LTC4364
U$9 U$10 = transistor-fet:BSS138CT-ND: ON Semiconductor BSS138 N-MOSFET, Logic Level Datasheet <http://www.mouser.com/ds/2/149/BSS138-1006682.pdf>
U$11 U$12 = texas:TL431: Texas Instruments TL431 Adjustable shunt regulator Datasheet <http://www.ti.com/lit/ds/symlink/tl431.pdf>